# Altium project PCB_MLIoT_ALICE.PrjPcb
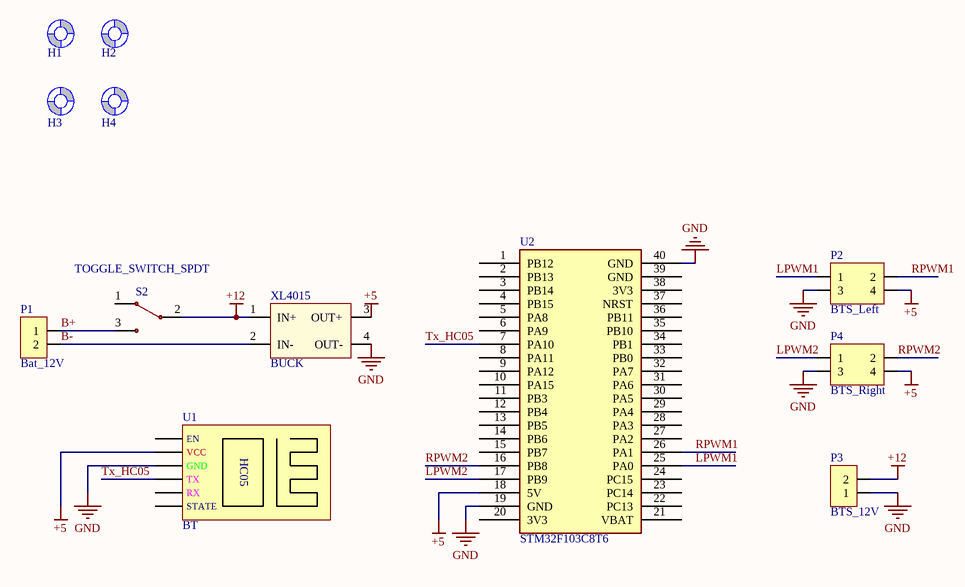
[diagram p0: Sch_ALICE.SchDoc]
1 sheet, 12 parts. Net scope: global (net labels, ports and power ports of the same name join across sheets).
Board file: PCB_ALICE.PcbDoc

## Sheet Sch_ALICE.SchDoc
size A4; SheetNumber: 1; SheetTotal: 1

### Parts
H1  Screw Hole  [SCREW/3.0/6.0]  (value not drawn)  (no BOM)
H2  Screw Hole  [SCREW/3.0/6.0]  (value not drawn)  (no BOM)
H3  Screw Hole  [SCREW/3.0/6.0]  (value not drawn)  (no BOM)
H4  Screw Hole  [SCREW/3.0/6.0]  (value not drawn)  (no BOM)
P1  Bat_12V  [HDR/Terminal/2/5mm]
P2  BTS_Left  [HDR/Header/4/DL]
P3  BTS_12V  [HDR/Terminal/2/5mm]
P4  BTS_Right  [HDR/Header/4/DL]
S2  TOGGLE_SWITCH_SPDT  [TOGGLE_SWITCH_SPDT]
U1  BT  [HC05]
U2  STM32F103C8T6  [Stm32 BluePill]
XL4015  BUCK  [PCBComponent_1]

### Nets
+5: P2.4 P4.4 U1.2 U2.18(5V) XL4015.3(OUT+)
+12: P3.2 S2.2 XL4015.1(IN+)
GND: P2.3 P3.1 P4.3 U1.3 U2.19(GND) U2.40(GND) XL4015.4(OUT-)
B+: P1.1 S2.3
B-: P1.2 XL4015.2(IN-)
LPWM1: P2.1 U2.25(PA0)
LPWM2: P4.1 U2.17(PB9)
RPWM1: P2.2 U2.26(PA1)
RPWM2: P4.2 U2.16(PB8)
Tx_HC05: U1.4 U2.7(PA10)

Not connected (* = marked no-connect by the designer): H1 1(Screw); H2 1(Screw); H3 1(Screw); H4 1(Screw); S2 1; U1 1 5 6; U2 1(PB12) 2(PB13) 3(PB14) 4(PB15) 5(PA8) 6(PA9) 8(PA11) 9(PA12) 10(PA15) 11(PB3) 12(PB4) 13(PB5) 14(PB6) 15(PB7) 20(3V3) 21(VBAT) 22(PC13) 23(PC14) 24(PC15) 27(PA2) 28(PA3) 29(PA4) 30(PA5) 31(PA6) 32(PA7) 33(PB0) 34(PB1) 35(PB10) 36(PB11) 37(NRST) 38(3V3) 39(GND)

### Notes on the sheet
- (in symbol HC05) EN; VCC; GND; TX; RX; STATE

### Library data of the parts
P1 P3 = Header 2: Header, 2-Pin
P2 P4 = Header 2X2: Header, 2-Pin, Dual row
S2 = TOGGLE_SWITCH_SPDT: Toggle Switch SPDT, 125V AC, 6A, 33x13x7mm.; JLCPCB PN: C2921493
U1 = HC05: Bluetooth HC05 Module
U2 = BluePill: Designed By @Alixahedi
H1-H4 = Screw Hole: TYPE: NO-BOM; UNIT PRICE: 0